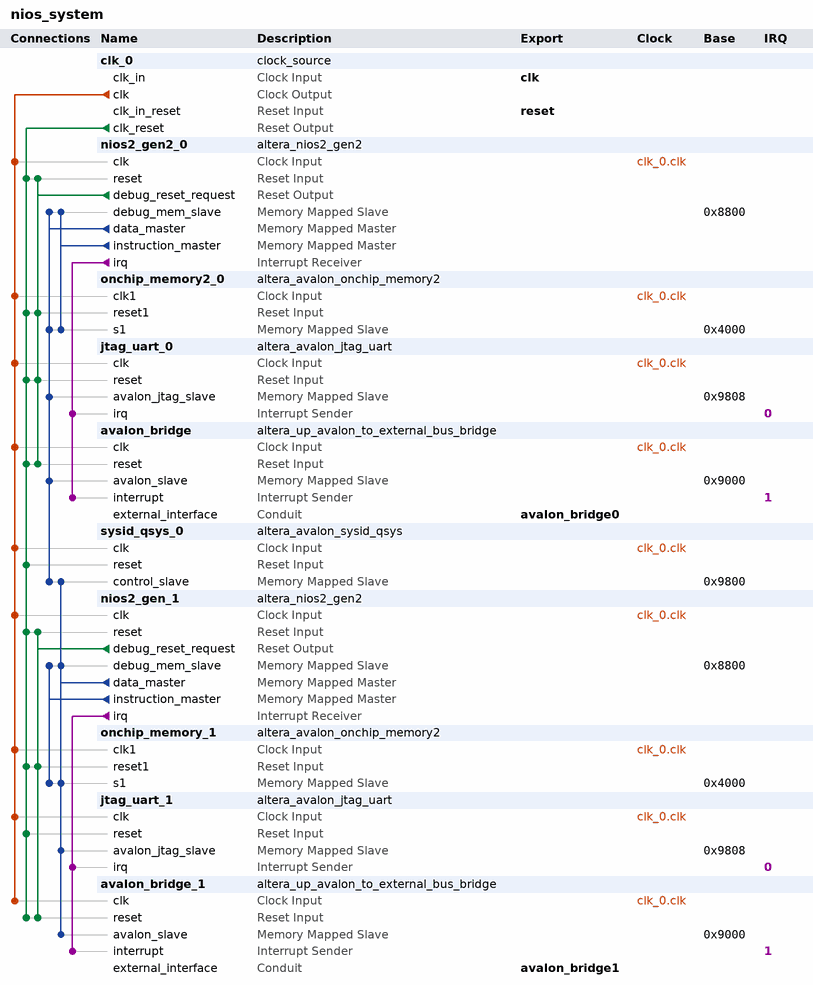
[diagram p0: system contents]
# Platform Designer (Qsys) system nios_system, Cyclone V 5CSEMA5F31C6
# Parameters at their usual value, and those the tool derives, are not listed.
package require -exact qsys 18.1
create_system nios_system
set_project_property DEVICE_FAMILY {Cyclone V}
set_project_property DEVICE 5CSEMA5F31C6

add_instance clk_0 clock_source 18.1
set_instance_parameter_value clk_0 clockFrequency 50000000

add_instance nios2_gen2_0 altera_nios2_gen2 18.1
set_instance_parameter_value nios2_gen2_0 dcache_size 2048
set_instance_parameter_value nios2_gen2_0 exceptionSlave onchip_memory2_0.s1
set_instance_parameter_value nios2_gen2_0 icache_size 4096
set_instance_parameter_value nios2_gen2_0 impl Tiny
set_instance_parameter_value nios2_gen2_0 resetSlave onchip_memory2_0.s1

add_instance onchip_memory2_0 altera_avalon_onchip_memory2 18.1
set_instance_parameter_value onchip_memory2_0 dataWidth 32
set_instance_parameter_value onchip_memory2_0 dualPort false
set_instance_parameter_value onchip_memory2_0 initMemContent true
set_instance_parameter_value onchip_memory2_0 initializationFileName onchip_mem.hex
set_instance_parameter_value onchip_memory2_0 memorySize 16384

add_instance jtag_uart_0 altera_avalon_jtag_uart 18.1
set_instance_parameter_value jtag_uart_0 simInteractiveOptions NO_INTERACTIVE_WINDOWS

add_instance avalon_bridge altera_up_avalon_to_external_bus_bridge 18.0
set_instance_parameter_value avalon_bridge addr_size 2
set_instance_parameter_value avalon_bridge addr_size_multiplier Kbytes
set_instance_parameter_value avalon_bridge data_size 16

add_instance sysid_qsys_0 altera_avalon_sysid_qsys 18.1
set_instance_parameter_value sysid_qsys_0 id 0

add_instance nios2_gen_1 altera_nios2_gen2 18.1
set_instance_parameter_value nios2_gen_1 dcache_size 2048
set_instance_parameter_value nios2_gen_1 exceptionSlave onchip_memory_1.s1
set_instance_parameter_value nios2_gen_1 icache_size 4096
set_instance_parameter_value nios2_gen_1 impl Tiny
set_instance_parameter_value nios2_gen_1 resetSlave onchip_memory_1.s1

add_instance onchip_memory_1 altera_avalon_onchip_memory2 18.1
set_instance_parameter_value onchip_memory_1 dataWidth 32
set_instance_parameter_value onchip_memory_1 dualPort false
set_instance_parameter_value onchip_memory_1 initMemContent true
set_instance_parameter_value onchip_memory_1 initializationFileName onchip_mem.hex
set_instance_parameter_value onchip_memory_1 memorySize 16384

add_instance jtag_uart_1 altera_avalon_jtag_uart 18.1
set_instance_parameter_value jtag_uart_1 simInteractiveOptions NO_INTERACTIVE_WINDOWS

add_instance avalon_bridge_1 altera_up_avalon_to_external_bus_bridge 18.0
set_instance_parameter_value avalon_bridge_1 addr_size 2
set_instance_parameter_value avalon_bridge_1 addr_size_multiplier Kbytes
set_instance_parameter_value avalon_bridge_1 data_size 16

# connections
add_connection clk_0.clk avalon_bridge.clk clock
add_connection clk_0.clk avalon_bridge_1.clk clock
add_connection clk_0.clk jtag_uart_0.clk clock
add_connection clk_0.clk jtag_uart_1.clk clock
add_connection clk_0.clk nios2_gen2_0.clk clock
add_connection clk_0.clk nios2_gen_1.clk clock
add_connection clk_0.clk onchip_memory2_0.clk1 clock
add_connection clk_0.clk onchip_memory_1.clk1 clock
add_connection clk_0.clk sysid_qsys_0.clk clock
add_connection clk_0.clk_reset avalon_bridge.reset reset
add_connection clk_0.clk_reset avalon_bridge_1.reset reset
add_connection clk_0.clk_reset jtag_uart_0.reset reset
add_connection clk_0.clk_reset jtag_uart_1.reset reset
add_connection clk_0.clk_reset nios2_gen2_0.reset reset
add_connection clk_0.clk_reset nios2_gen_1.reset reset
add_connection clk_0.clk_reset onchip_memory2_0.reset1 reset
add_connection clk_0.clk_reset onchip_memory_1.reset1 reset
add_connection clk_0.clk_reset sysid_qsys_0.reset reset
add_connection nios2_gen2_0.debug_reset_request avalon_bridge.reset reset
add_connection nios2_gen2_0.debug_reset_request jtag_uart_0.reset reset
add_connection nios2_gen2_0.debug_reset_request nios2_gen2_0.reset reset
add_connection nios2_gen2_0.debug_reset_request onchip_memory2_0.reset1 reset
add_connection nios2_gen_1.debug_reset_request avalon_bridge_1.reset reset
add_connection nios2_gen_1.debug_reset_request nios2_gen_1.reset reset
add_connection nios2_gen_1.debug_reset_request onchip_memory_1.reset1 reset
add_connection nios2_gen2_0.data_master avalon_bridge.avalon_slave avalon
set_connection_parameter_value nios2_gen2_0.data_master/avalon_bridge.avalon_slave baseAddress 0x9000
add_connection nios2_gen2_0.data_master jtag_uart_0.avalon_jtag_slave avalon
set_connection_parameter_value nios2_gen2_0.data_master/jtag_uart_0.avalon_jtag_slave baseAddress 0x9808
add_connection nios2_gen2_0.data_master nios2_gen2_0.debug_mem_slave avalon
set_connection_parameter_value nios2_gen2_0.data_master/nios2_gen2_0.debug_mem_slave baseAddress 0x8800
add_connection nios2_gen2_0.data_master onchip_memory2_0.s1 avalon
set_connection_parameter_value nios2_gen2_0.data_master/onchip_memory2_0.s1 baseAddress 0x4000
add_connection nios2_gen2_0.data_master sysid_qsys_0.control_slave avalon
set_connection_parameter_value nios2_gen2_0.data_master/sysid_qsys_0.control_slave baseAddress 0x9800
add_connection nios2_gen2_0.instruction_master nios2_gen2_0.debug_mem_slave avalon
set_connection_parameter_value nios2_gen2_0.instruction_master/nios2_gen2_0.debug_mem_slave baseAddress 0x8800
add_connection nios2_gen2_0.instruction_master onchip_memory2_0.s1 avalon
set_connection_parameter_value nios2_gen2_0.instruction_master/onchip_memory2_0.s1 baseAddress 0x4000
add_connection nios2_gen_1.data_master avalon_bridge_1.avalon_slave avalon
set_connection_parameter_value nios2_gen_1.data_master/avalon_bridge_1.avalon_slave baseAddress 0x9000
add_connection nios2_gen_1.data_master jtag_uart_1.avalon_jtag_slave avalon
set_connection_parameter_value nios2_gen_1.data_master/jtag_uart_1.avalon_jtag_slave baseAddress 0x9808
add_connection nios2_gen_1.data_master nios2_gen_1.debug_mem_slave avalon
set_connection_parameter_value nios2_gen_1.data_master/nios2_gen_1.debug_mem_slave baseAddress 0x8800
add_connection nios2_gen_1.data_master onchip_memory_1.s1 avalon
set_connection_parameter_value nios2_gen_1.data_master/onchip_memory_1.s1 baseAddress 0x4000
add_connection nios2_gen_1.data_master sysid_qsys_0.control_slave avalon
set_connection_parameter_value nios2_gen_1.data_master/sysid_qsys_0.control_slave baseAddress 0x9800
add_connection nios2_gen_1.instruction_master nios2_gen_1.debug_mem_slave avalon
set_connection_parameter_value nios2_gen_1.instruction_master/nios2_gen_1.debug_mem_slave baseAddress 0x8800
add_connection nios2_gen_1.instruction_master onchip_memory_1.s1 avalon
set_connection_parameter_value nios2_gen_1.instruction_master/onchip_memory_1.s1 baseAddress 0x4000
add_connection nios2_gen2_0.irq avalon_bridge.interrupt interrupt
set_connection_parameter_value nios2_gen2_0.irq/avalon_bridge.interrupt irqNumber 1
add_connection nios2_gen2_0.irq jtag_uart_0.irq interrupt
set_connection_parameter_value nios2_gen2_0.irq/jtag_uart_0.irq irqNumber 0
add_connection nios2_gen_1.irq avalon_bridge_1.interrupt interrupt
set_connection_parameter_value nios2_gen_1.irq/avalon_bridge_1.interrupt irqNumber 1
add_connection nios2_gen_1.irq jtag_uart_1.irq interrupt
set_connection_parameter_value nios2_gen_1.irq/jtag_uart_1.irq irqNumber 0

# exported interfaces
add_interface avalon_bridge0 conduit end
set_interface_property avalon_bridge0 EXPORT_OF avalon_bridge.external_interface
add_interface avalon_bridge1 conduit end
set_interface_property avalon_bridge1 EXPORT_OF avalon_bridge_1.external_interface
add_interface clk clock sink
set_interface_property clk EXPORT_OF clk_0.clk_in
add_interface reset reset sink
set_interface_property reset EXPORT_OF clk_0.clk_in_reset

set_interconnect_requirement {$system} qsys_mm.clockCrossingAdapter HANDSHAKE
set_interconnect_requirement {$system} qsys_mm.enableEccProtection FALSE
set_interconnect_requirement {$system} qsys_mm.insertDefaultSlave FALSE
set_interconnect_requirement {$system} qsys_mm.maxAdditionalLatency 1

save_system nios_system.qsys
